# Altium project PAY_IF.PrjPcb (part 7 of 7)
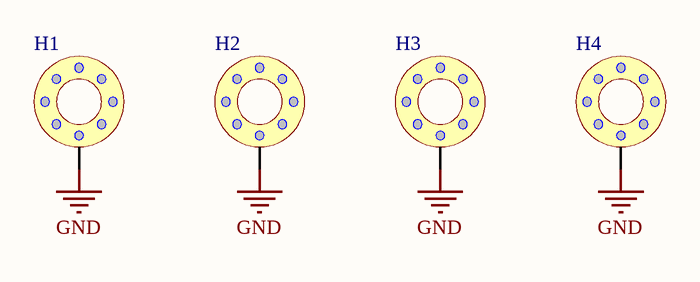
[diagram p30: MOUNTING_HOLE.SchDoc]

## Nets that join several sheets
3.3_VBAT: Power (C13.1 J4.1), SAMA7D65_MPU (R72.1), RTC (C163.2 U14.9)
3V3: SAMA7D65_PMIC (14 pins), SAMA7D65_MPU (19 pins), SAMA7D65_PIO (10 pins), SDCARD (14 pins), EEPROM (C153.2 C154.2 R201.1 U9.8), USB_SWITCH (C182.2 C183.2 R241.2 U23.4), DEBUG_CONSOLE (C155.2 J16.1 R203.1 R204.1), TEMP (6 pins), RTC (5 pins), WATCHDOG (C164.2 U15.1)
3V3_COM: Power (5 pins), CONNECTOR_INTERFACE (5 pins), LVDS (12 pins), CAN_PHY (6 pins), RS422 (6 pins)
3V3_eMMC: Power (5 pins), SAMA7D65_MPU (C64.2 C65.2 U5.F9 U5.W17), eMMC (70 pins)
5V: Power (10 pins), SAMA7D65_PMIC (13 pins)
12V_CONN: Power (9 pins), CONNECTOR_EXP (C1.2 J1.1 J1.2 J1.3)
GND: Power (39 pins), CONNECTOR_EXP (8 pins), CONNECTOR_INTERFACE (26 pins), SAMA7D65_PMIC (27 pins), SAMA7D65_MPU (99 pins), SAMA7D65_PIO (J14#1.3 R168.2), SAMA7D65_DDR3L (85 pins), SDCARD (11 pins), eMMC (58 pins), EEPROM (C153.1 C154.1 U9.4), USB_SWITCH (6 pins), DEBUG_CONSOLE (12 pins), TEMP (9 pins), RTC (C162.1 C163.1 U14.6), WATCHDOG (C164.1 R214.2 R215.2 U15.2), LVDS (12 pins), CAN_PHY (12 pins), RS422 (6 pins), BUTTON_LED (BT1.1 C179.1 R233.1 R234.1), MOUNTING_HOLE (H1#2.1 H2#2.1 H3.1 H4.1)
VDDBU: SAMA7D65_PMIC (R50.2), SAMA7D65_MPU (C78.2 R65.2 R72.2 U5.E8)
VDDCORE: SAMA7D65_PMIC (R60.2 TP9.0), SAMA7D65_MPU (30 pins)
VDDCPU: SAMA7D65_PMIC (R61.2 TP10.0), SAMA7D65_MPU (11 pins)
VDDIODDR: SAMA7D65_PMIC (R59.2 TP7.0), SAMA7D65_DDR3L (73 pins)
ADC_TEMP_1: SAMA7D65_PIO (R134.2), TEMP (C157.2 R205.2)
ADC_TEMP_2: SAMA7D65_PIO (R136.2), TEMP (C159.2 R206.2)
ADC_TEMP_3: SAMA7D65_PIO (R138.2), TEMP (C161.2 R207.2)
CAN_H_main: CONNECTOR_EXP (J1.9), CONNECTOR_INTERFACE (H2#1.03 R31.1), CAN_PHY (R220.2)
CAN_L_main: CONNECTOR_EXP (J1.8), CONNECTOR_INTERFACE (H2#1.01 R32.2), CAN_PHY (R221.2)
EXP_USB_N: CONNECTOR_EXP (J2.8), CONNECTOR_INTERFACE (R33.1), SAMA7D65_MPU (U5.G1)
EXP_USB_P: CONNECTOR_EXP (J2.7), CONNECTOR_INTERFACE (R34.1), SAMA7D65_MPU (U5.G2)
FLEXCOM1_I2C_SCL: CONNECTOR_EXP (J2.6), CONNECTOR_INTERFACE (R30.2 R38.1), SAMA7D65_PIO (R87.2 R127.2)
FLEXCOM1_I2C_SDA: CONNECTOR_EXP (J2.5), CONNECTOR_INTERFACE (R28.2 R35.1), SAMA7D65_PIO (R80.2 R128.2)
FLEXCOM2_SPI_CLK: SAMA7D65_PIO (R165.2), LVDS (U19.5)
FLEXCOM2_SPI_MISO: SAMA7D65_PIO (R167#1.2), LVDS (U18.5)
FLEXCOM3_UART_RX: SAMA7D65_PIO (R107.2), RS422 (U22#2.1)
FLEXCOM3_UART_TX: SAMA7D65_PIO (R109.2), RS422 (U22#2.4)
FLEXCOM4_I2C_SCL: CONNECTOR_INTERFACE (J9.05), SAMA7D65_PIO (R100.2 R121.2)
FLEXCOM4_I2C_SDA: CONNECTOR_INTERFACE (J9.06), SAMA7D65_PIO (R102.2 R119.2)
FLEXCOM5_I2C_SCL: CONNECTOR_INTERFACE (R29.1), SAMA7D65_PIO (R101.2 R141.2)
FLEXCOM5_I2C_SDA: CONNECTOR_INTERFACE (R27.1), SAMA7D65_PIO (R98.2 R139.2)
FLEXCOM6_UART_TX: CONNECTOR_INTERFACE (J13.14 R25.1), SAMA7D65_PIO (R116.2)
FLEXCOM7_UART_RX: CONNECTOR_INTERFACE (J13.11), SAMA7D65_PIO (R130.2)
FLEXCOM7_UART_TX: CONNECTOR_INTERFACE (J13.12), SAMA7D65_PIO (R129.2)
FLEXCOM8_SPI_CK: SAMA7D65_PIO (R77.2), LVDS (U17.5)
FLEXCOM8_SPI_MOSI: SAMA7D65_PIO (R117.2), LVDS (U16.5)
FLEXCOM9_UART_RX_DEBUG: SAMA7D65_PIO (R126.2), DEBUG_CONSOLE (J16.3 R204.2)
FLEXCOM9_UART_TX_DEBUG: SAMA7D65_PIO (R124.2), DEBUG_CONSOLE (J16.2 R203.2)
HPM_MCP16502: SAMA7D65_PMIC (R46.1), SAMA7D65_PIO (R113.2 R166#1.2 R168.1)
LPM: SAMA7D65_PMIC (R45.1 TP4.0), SAMA7D65_MPU (U5.A6)
LVDS_RXC_N: CONNECTOR_INTERFACE (J8.9), LVDS (R219.2 U19.4)
LVDS_RXC_P: CONNECTOR_INTERFACE (J8.8), LVDS (R219.1 U19.3)
LVDS_RXD_N: CONNECTOR_INTERFACE (J8.4), LVDS (R218.2 U18.4)
LVDS_RXD_P: CONNECTOR_INTERFACE (J8.3), LVDS (R218.1 U18.3)
LVDS_TXC_N: CONNECTOR_INTERFACE (J8.7), LVDS (R217.2 U17.3)
LVDS_TXC_P: CONNECTOR_INTERFACE (J8.6), LVDS (R217.1 U17.4)
LVDS_TXD_N: CONNECTOR_INTERFACE (J8.2), LVDS (R216.2 U16.3)
LVDS_TXD_P: CONNECTOR_INTERFACE (J8.1), LVDS (R216.1 U16.4)
MRAM_QSPI_CLK: SAMA7D65_PIO (R97.2), EEPROM (U9.6)
MRAM_QSPI_CS: SAMA7D65_PIO (R96.2), EEPROM (R201.2 U9.1)
MRAM_QSPI_D0: SAMA7D65_PIO (R95.2), EEPROM (U9.5)
MRAM_QSPI_D1: SAMA7D65_PIO (R93.2), EEPROM (U9.2)
MRAM_QSPI_D2: SAMA7D65_PIO (R91.2), EEPROM (U9.3)
MRAM_QSPI_D3: SAMA7D65_PIO (R89.2), EEPROM (U9.7)
NetCR1_3: SAMA7D65_PIO (R151.2), SDCARD (CR1.3 J15.P5 R198.1)
NetCR1_4: SAMA7D65_PIO (R152.2), SDCARD (CR1.4 J15.P7 R194.1)
NetCR1_6: SAMA7D65_PIO (R154.2), SDCARD (CR1.6 J15.P8 R195.1)
NetCR2_1: SAMA7D65_PIO (R150.2), SDCARD (CR2.1 J15.P3 R199.1)
NetCR2_4: SAMA7D65_PIO (R156.2), SDCARD (CR2.4 J15.P1 R196.1)
NetCR2_6: SAMA7D65_PIO (R120.2), SDCARD (CR2.6 J15.P2 R197.1)
NetD4_2: Power (D4.2 R7.1 U1.1), CONNECTOR_EXP (R1.2)
NetD12_2: SAMA7D65_PIO (R155.2), BUTTON_LED (D12.2)
NetD13_2: SAMA7D65_PIO (R157.2), BUTTON_LED (D13.2)
NetJ9_07: CONNECTOR_INTERFACE (J9.07 R31.2), CAN_PHY (R226#1.2)
NetJ9_08: CONNECTOR_INTERFACE (J9.08 R32.1), CAN_PHY (R227#1.2)
NetJ13_19: CONNECTOR_INTERFACE (J13.19 R26.2), SAMA7D65_PIO (R125.2)
NetJ15_P9: SAMA7D65_PIO (R123.2), SDCARD (J15.P9 R200.1)
NetR9_1: Power (R9.1 U1.9), SAMA7D65_PIO (R132.2)
NetR52_1: SAMA7D65_PMIC (R52.1 U3#2.1), SAMA7D65_PIO (R122.2)
NetR54_1: SAMA7D65_PMIC (R54.1 U4.1), SAMA7D65_PIO (R118.2)
NetR111_2: SAMA7D65_PIO (R111.2), WATCHDOG (R213.2)
NetR131_2: SAMA7D65_PIO (R131.2), CAN_PHY (U20.1)
NetR133_2: SAMA7D65_PIO (R133.2), CAN_PHY (U20.4)
NetR135_2: SAMA7D65_PIO (R135.2), CAN_PHY (U21.1)
NetR137_2: SAMA7D65_PIO (R137.2), CAN_PHY (U21.4)
NetR140_2: SAMA7D65_PIO (R140.2), RTC (R208.2 U14.3)
NetR142_2: SAMA7D65_PIO (R142.2), USB_SWITCH (R241.1 U23.15)
NetR143_2: SAMA7D65_PIO (R143.2), USB_SWITCH (R242.2 U23.6)
NetR144_2: SAMA7D65_PIO (R144.2), USB_SWITCH (R243.2 U23.5)
NetR158_2: SAMA7D65_PMIC (U3#2.5), SAMA7D65_PIO (R158.2)
NetR162_2: SAMA7D65_PMIC (U3#2.6), SAMA7D65_PIO (R162.2)
NetR169_2: SAMA7D65_PIO (R169.2), RTC (R209.2 U14.7)
NetR170_2: SAMA7D65_PIO (R170.2), WATCHDOG (R212.2)
NRST: SAMA7D65_PMIC (R51.1 U3#2.2), SAMA7D65_MPU (C48.1 R62.2 U5.D3), WATCHDOG (R211.2), BUTTON_LED (R232.2)
PAC1934_TWCK: SAMA7D65_PMIC (R49.2 U4.4), SAMA7D65_PIO (R163.2)
PAC1934_TWD: SAMA7D65_PMIC (R48.2 U4.5), SAMA7D65_PIO (R159.2)
RS422_DE: SAMA7D65_PIO (R105.2), RS422 (R240.2 U22#2.3)
RS422_~{RE}: SAMA7D65_PIO (R103.2), RS422 (R236.1 U22#2.2)
RS_422_RX_N: CONNECTOR_INTERFACE (J5.5 R16#1.1 R23.1), RS422 (JP3.1 R238.2 U22#2.10)
RS_422_RX_P: CONNECTOR_INTERFACE (J5.6 R15#2.1 R24.2), RS422 (JP2.1 R238.1 U22#2.11)
RS_422_TX_N: CONNECTOR_INTERFACE (J5.4 R18#1.1), RS422 (JP3.2 R239.1 U22#2.9)
RS_422_TX_P: CONNECTOR_INTERFACE (J5.3 R17.1), RS422 (JP2.2 R239.2 U22#2.8)
SAM_RTC_I2C_SCL: SAMA7D65_PIO (R164.2), RTC (U14.4)
SAM_RTC_I2C_SDA: SAMA7D65_PIO (R160.2), RTC (U14.5)
SDMMC0_CLK: SAMA7D65_PIO (R75.2), eMMC (R184.2 U7.P6)
SDMMC0_CMD: SAMA7D65_PIO (R76.2), eMMC (R185.2 U7.P5)
SDMMC0_D0: SAMA7D65_PIO (R79.2), eMMC (R176.2 U7.K2)
SDMMC0_D1: SAMA7D65_PIO (R81.2), eMMC (R177.2 U7.N2)
SDMMC0_D2: SAMA7D65_PIO (R90.2), eMMC (R178.2 U7.K3)
SDMMC0_D3: SAMA7D65_PIO (R92.2), eMMC (R179.2 U7.N3)
SDMMC0_D4: SAMA7D65_PIO (R82.2), eMMC (R180.2 U7.N8)
SDMMC0_D5: SAMA7D65_PIO (R83.2), eMMC (R181.2 U7.K8)
SDMMC0_D6: SAMA7D65_PIO (R85.2), eMMC (R182.2 U7.N9)
SDMMC0_D7: SAMA7D65_PIO (R88.2), eMMC (R183.2 U7.K9)
SDMMC0_DS: SAMA7D65_PIO (R94.2), eMMC (U7.K5)
SDMMC0_NRST: SAMA7D65_PIO (R78.2), eMMC (R186.2 U7.M5)
SDMMC1_CLK: SAMA7D65_PIO (R108.2), eMMC (R191.2 U8.P6)
SDMMC1_CMD: SAMA7D65_PIO (R106.2), eMMC (R192.2 U8.P5)
SDMMC1_D0: SAMA7D65_PIO (R110.2), eMMC (R187.2 U8.K2)
SDMMC1_D1: SAMA7D65_PIO (R112.2), eMMC (R188.2 U8.N2)
SDMMC1_D2: SAMA7D65_PIO (R114.2), eMMC (R189.2 U8.K3)
SDMMC1_D3: SAMA7D65_PIO (R115.2), eMMC (R190.2 U8.N3)
SDMMC1_NRST: SAMA7D65_PIO (R104.2), eMMC (R193.2 U8.M5)
SHDN: SAMA7D65_PMIC (R47.1), SAMA7D65_MPU (U5.B4)
SPI_CLK_EXP: CONNECTOR_EXP (J2.4), CONNECTOR_INTERFACE (R20.1 R37.1)
SPI_CS_EXP: CONNECTOR_EXP (J2.2), CONNECTOR_INTERFACE (R19.1 R36.1)
SPI_MISO_EXP: CONNECTOR_EXP (J2.3), CONNECTOR_INTERFACE (R22.1 R40.1)
SPI_MOSI_EXP: CONNECTOR_EXP (J2.1), CONNECTOR_INTERFACE (R21.1 R39.1)
STX_GPIO: CONNECTOR_INTERFACE (R14#2.2), SAMA7D65_PIO (R99.2)
USB_CONNECTOR_N: CONNECTOR_INTERFACE (J10.2 R33.2), USB_SWITCH (U23.11)
USB_CONNECTOR_P: CONNECTOR_INTERFACE (J10.3 R34.2), USB_SWITCH (U23.12)
USB_DEBUG_N: USB_SWITCH (U23.14), DEBUG_CONSOLE (U10#2.2)
USB_DEBUG_P: USB_SWITCH (U23.13), DEBUG_CONSOLE (U10#2.3)
USBA_N: SAMA7D65_MPU (U5.F1), USB_SWITCH (U23.3)
USBA_P: SAMA7D65_MPU (U5.F2), USB_SWITCH (U23.2)
WKUP: SAMA7D65_PMIC (R50.1 U3#2.7), SAMA7D65_MPU (U5.A8)